# EAGLE schematic hirose_omnetics_adapter_schematic (EAGLE 7.2.0)
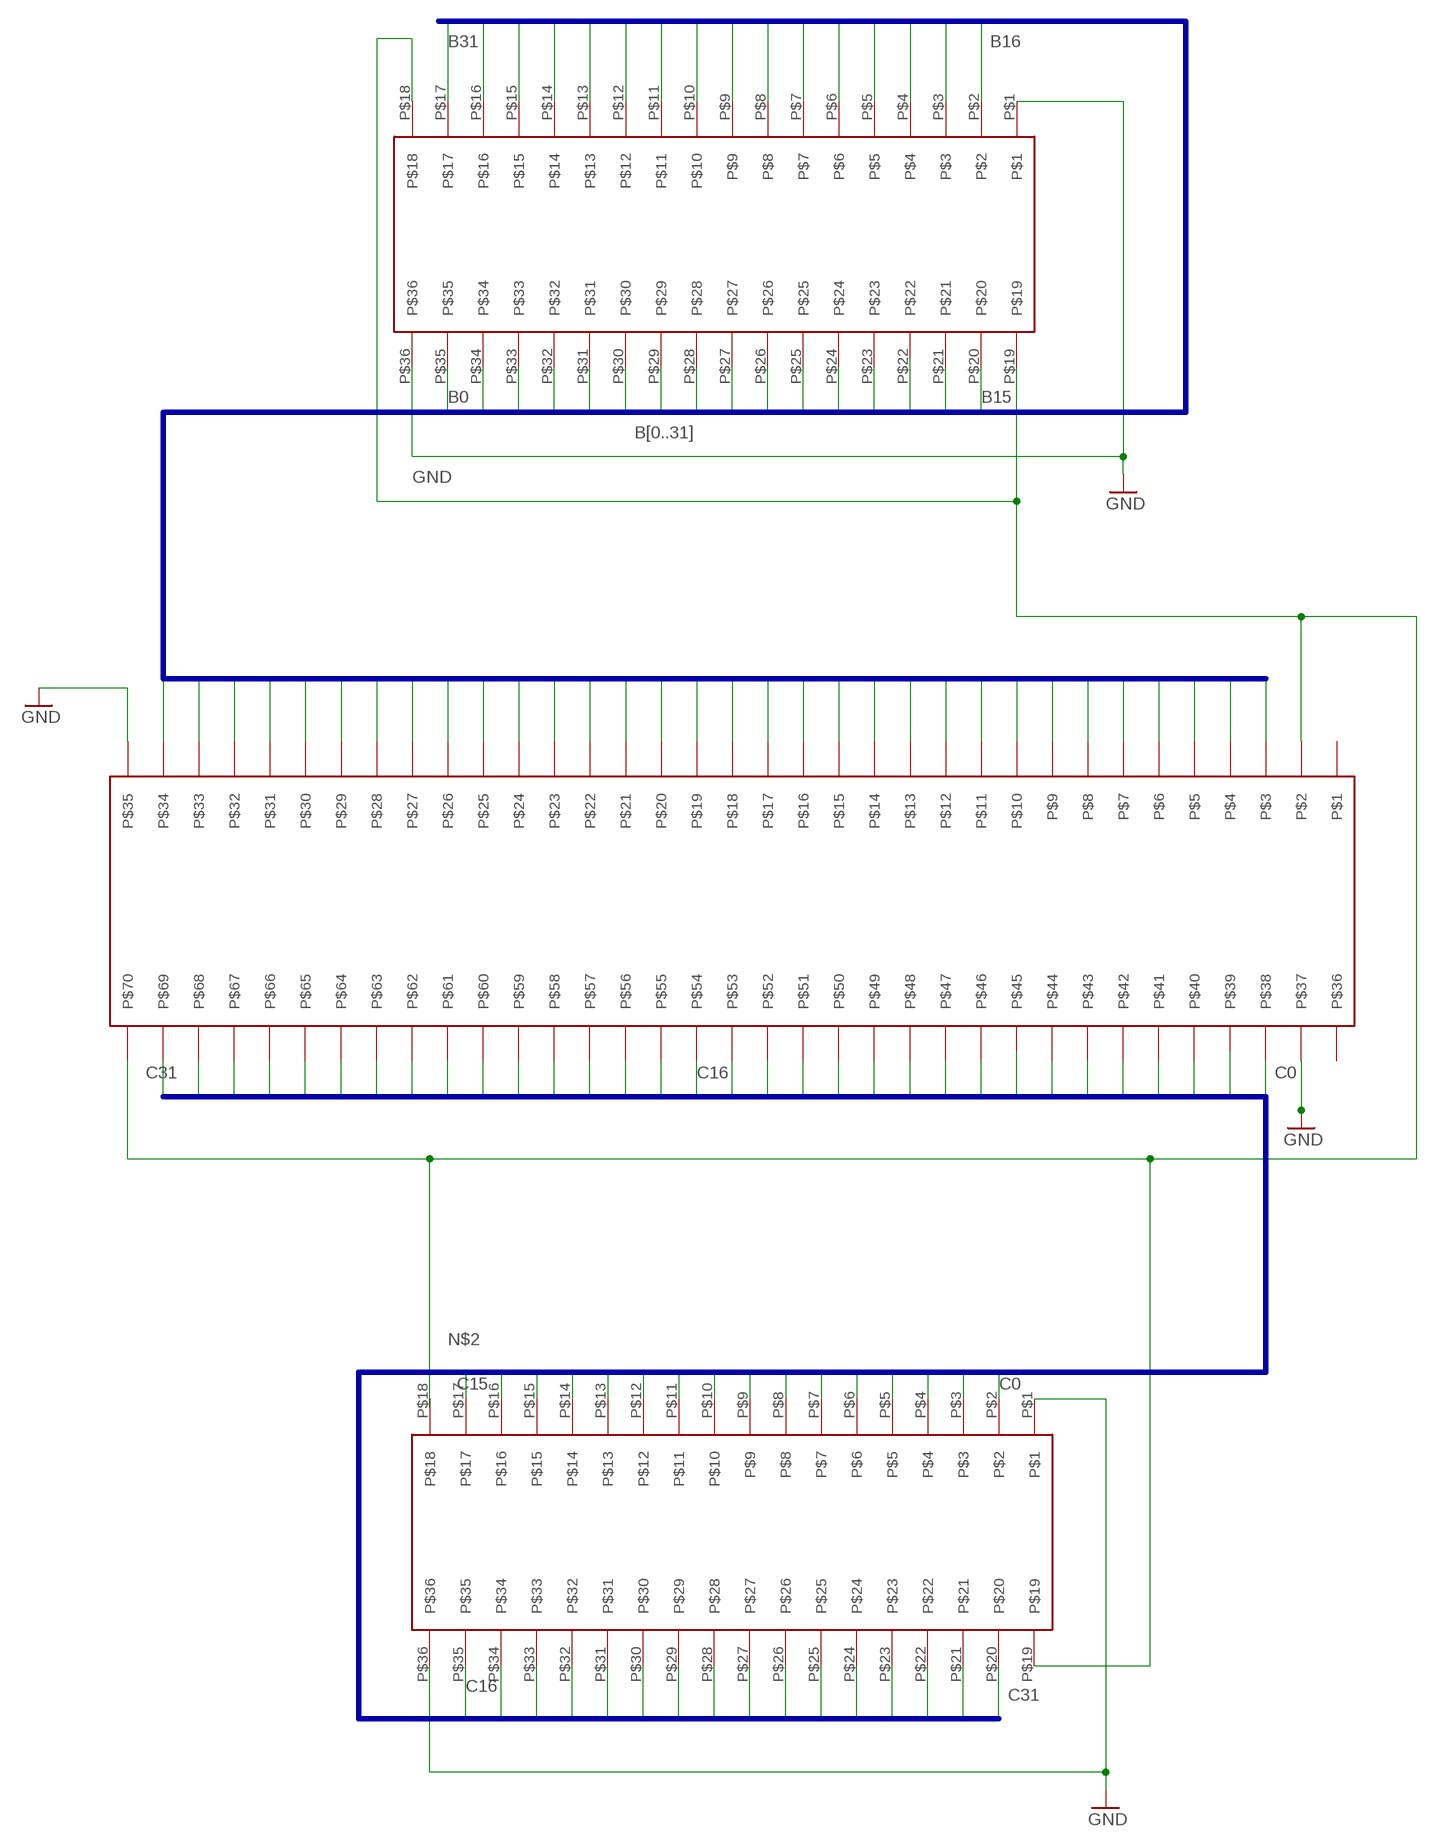
[diagram p0: schematic, sheet 1]

## Parts
U$1  HIROSE_DF40_70PIN  [HIROSE_DF40C-70DS]
U$2  OMNETICS_A79026  [OMNETICS_A79026-001]
U$3  OMNETICS_A79026  [OMNETICS_A79026-001]

## Nets
B0: U$1.P$3 U$2.P$35
B1: U$1.P$4 U$2.P$34
B2: U$1.P$5 U$2.P$33
B3: U$1.P$6 U$2.P$32
B4: U$1.P$7 U$2.P$31
B5: U$1.P$8 U$2.P$30
B6: U$1.P$9 U$2.P$29
B7: U$1.P$10 U$2.P$28
B8: U$1.P$11 U$2.P$27
B9: U$1.P$12 U$2.P$26
B10: U$1.P$13 U$2.P$25
B11: U$1.P$14 U$2.P$24
B12: U$1.P$15 U$2.P$23
B13: U$1.P$16
B14: U$1.P$17 U$2.P$21
B15: U$1.P$18 U$2.P$20
B16: U$1.P$19 U$2.P$2
B17: U$1.P$20 U$2.P$3
B18: U$1.P$21 U$2.P$4
B19: U$1.P$22 U$2.P$5
B20: U$1.P$23 U$2.P$6
B21: U$1.P$24 U$2.P$7
B22: U$1.P$25 U$2.P$8
B23: U$1.P$26 U$2.P$9
B24: U$1.P$27 U$2.P$10
B25: U$1.P$28 U$2.P$11
B26: U$1.P$29 U$2.P$12
B27: U$1.P$30 U$2.P$13
B28: U$1.P$31 U$2.P$14
B29: U$1.P$32 U$2.P$15
B30: U$1.P$33 U$2.P$16
B31: U$1.P$34 U$2.P$17
C0: U$1.P$38 U$3.P$2
C1: U$3.P$3
C2: U$1.P$40 U$3.P$4
C3: U$1.P$41 U$3.P$5
C4: U$1.P$42 U$3.P$6
C5: U$1.P$43 U$3.P$7
C6: U$1.P$44 U$3.P$8
C7: U$3.P$9
C8: U$1.P$46 U$3.P$10
C9: U$1.P$47 U$3.P$11
C10: U$1.P$48 U$3.P$12
C11: U$1.P$49 U$3.P$13
C12: U$1.P$50 U$3.P$14
C13: U$1.P$51 U$3.P$15
C14: U$1.P$52 U$3.P$16
C15: U$1.P$53 U$3.P$17
C16: U$1.P$54 U$3.P$35
C17: U$1.P$55 U$3.P$34
C18: U$1.P$56 U$3.P$33
C19: U$1.P$57 U$3.P$32
C20: U$1.P$58 U$3.P$31
C21: U$1.P$59 U$3.P$30
C22: U$1.P$60 U$3.P$29
C23: U$1.P$61 U$3.P$28
C24: U$1.P$62 U$3.P$27
C25: U$1.P$63 U$3.P$26
C26: U$1.P$64 U$3.P$25
C27: U$1.P$65 U$3.P$24
C28: U$1.P$66 U$3.P$23
C29: U$1.P$67 U$3.P$22
C30: U$1.P$68 U$3.P$21
C31: U$1.P$69 U$3.P$20
GND: U$1.P$35 U$1.P$37 U$2.P$1 U$2.P$36 U$3.P$1 U$3.P$36
N$2: U$1.P$2 U$1.P$70 U$2.P$18 U$2.P$19 U$3.P$19
Unconnected: U$1.P$1 U$1.P$36 U$1.P$39 U$1.P$45 U$2.P$22 U$3.P$18

## Buses
B[0..31]
C[0..31]

## Library data of the parts
U$1 = GG_hirose70:HIROSE_DF40_70PIN
U$2 U$3 = Omnetics_A79026-001:OMNETICS_A79026